# EAGLE design dsd01-bsta (EAGLE 7.7.0)
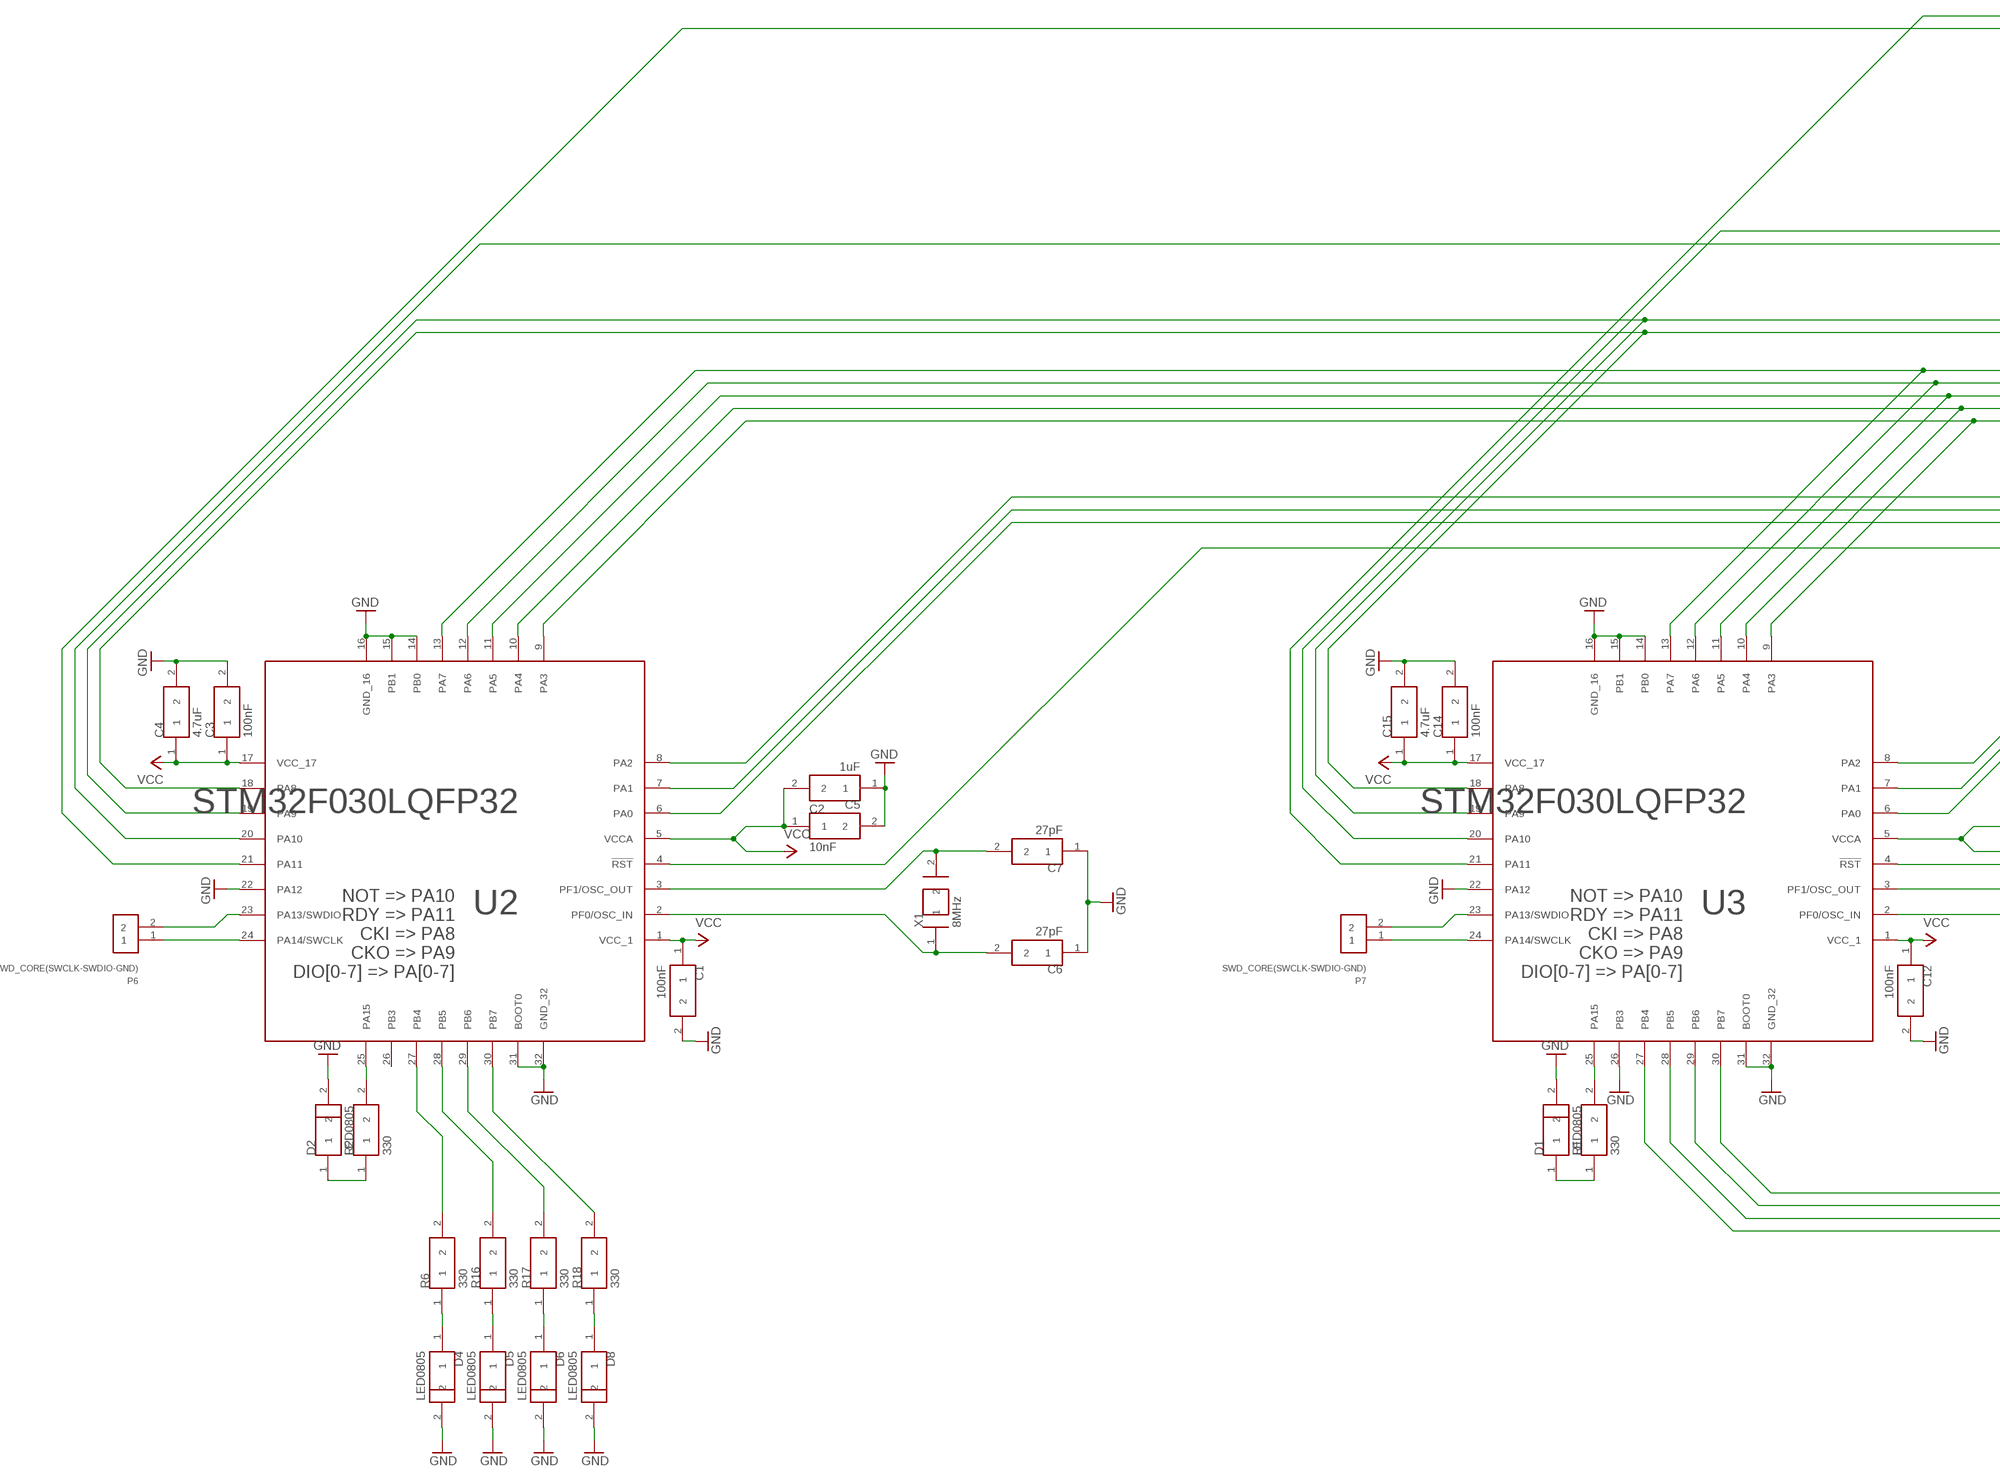
[diagram p0: schematic, sheet 1, part 1 of 2]
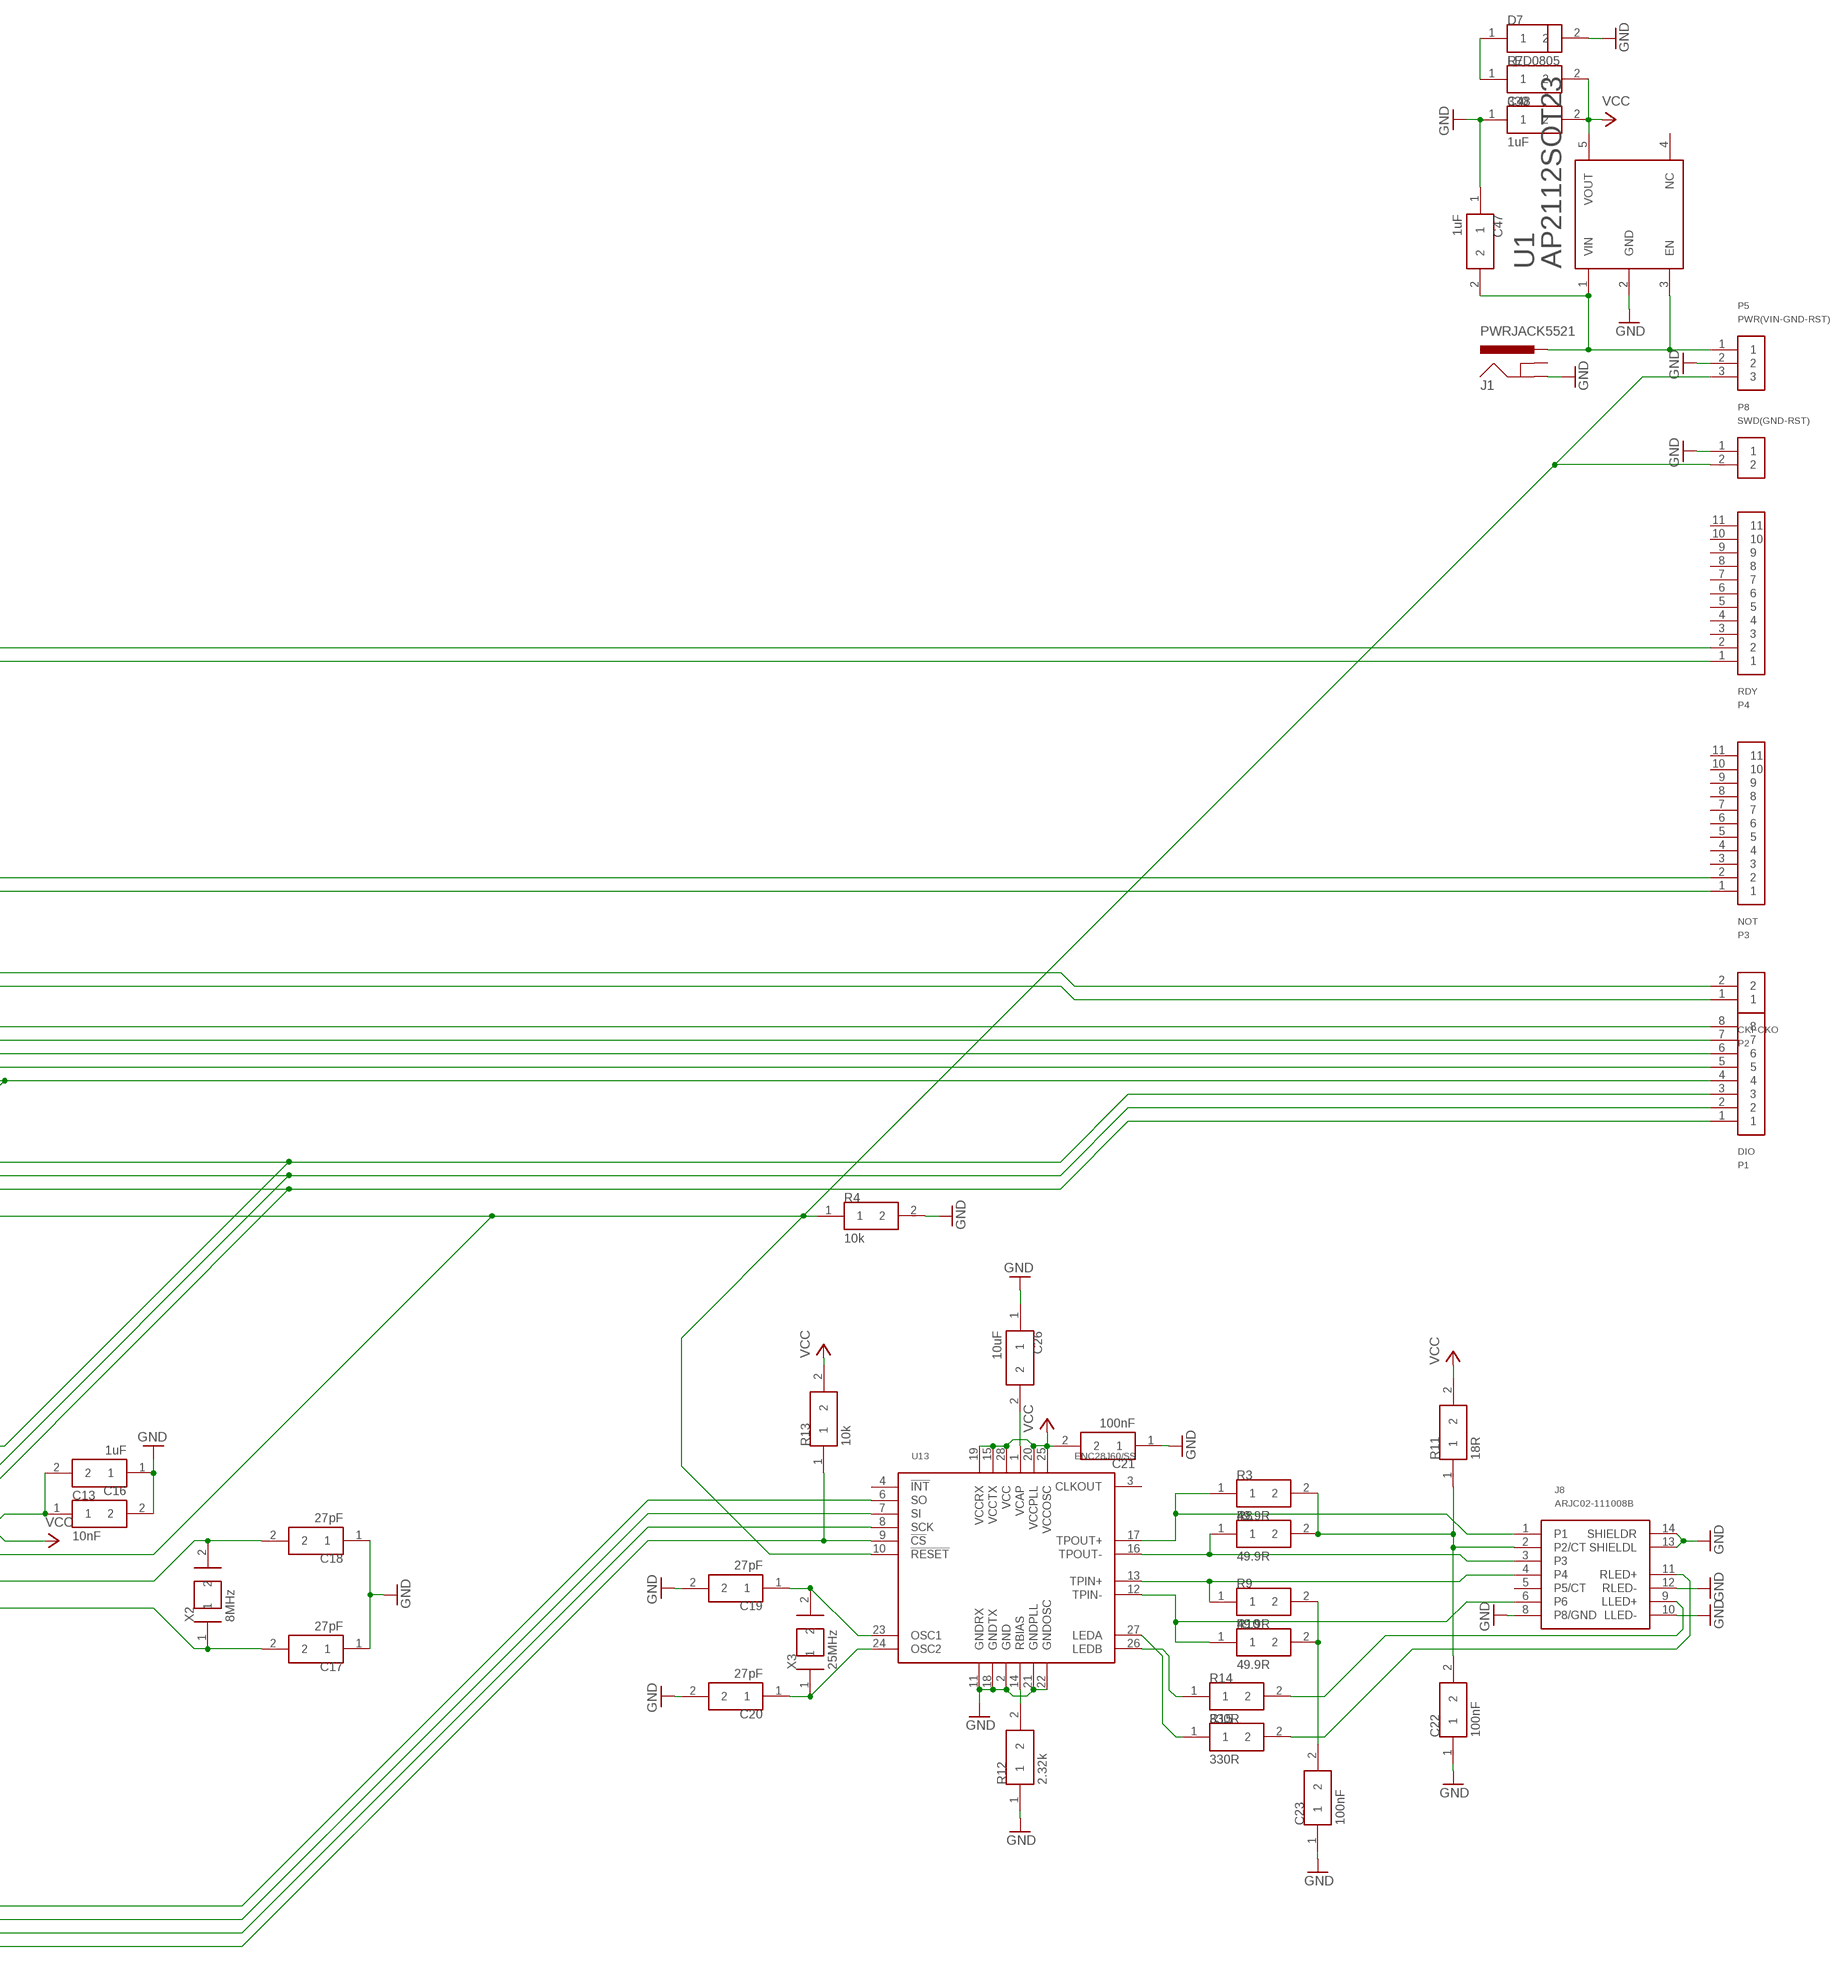
[diagram p1: schematic, sheet 1, part 2 of 2]

## Parts
C1  100nF  CAP0805  [0805]
C2  10nF  CAP0805  [0805]
C3  100nF  CAP0805  [0805]
C4  4.7uF  CAP0805  [0805]
C5  1uF  CAP0805  [0805]
C6  27pF  CAP0805  [0805]
C7  27pF  CAP0805  [0805]
C12  100nF  CAP0805  [0805]
C13  10nF  CAP0805  [0805]
C14  100nF  CAP0805  [0805]
C15  4.7uF  CAP0805  [0805]
C16  1uF  CAP0805  [0805]
C17  27pF  CAP0805  [0805]
C18  27pF  CAP0805  [0805]
C19  27pF  CAP0805  [0805]
C20  27pF  CAP0805  [0805]
C21  100nF  CAP0805  [0805]
C22  100nF  CAP0805  [0805]
C23  100nF  CAP0805  [0805]
C26  10uF  CAP0805  [0805]
C47  1uF  CAP0805  [0805]
C48  1uF  CAP0805  [0805]
D1  LED0805  [0805]
D2  LED0805  [0805]
D4  LED0805  [0805]
D5  LED0805  [0805]
D6  LED0805  [0805]
D7  LED0805  [0805]
D8  LED0805  [0805]
J1  PWRJACK5521  [PWRJACK_5521]
J8  ARJC02-111008B  [ARJC02-111008B]
P1  DIO  PIN_8  [PIN_8]
P2  CKI-CKO  PIN_2  [PIN_2]
P3  NOT  PIN_11  [PIN_11]
P4  RDY  PIN_11  [PIN_11]
P5  PWR(VIN-GND-RST)  PIN_3  [PIN_3]
P6  SWD_CORE(SWCLK-SWDIO-GND)  PIN_2  [PIN_2]
P7  SWD_CORE(SWCLK-SWDIO-GND)  PIN_2  [PIN_2]
P8  SWD(GND-RST)  PIN_2  [PIN_2]
R1  330  RES0805  [0805]
R2  330  RES0805  [0805]
R3  49.9R  RES0805  [0805]
R4  10k  RES0805  [0805]
R6  330  RES0805  [0805]
R7  330  RES0805  [0805]
R8  49.9R  RES0805  [0805]
R9  49.9R  RES0805  [0805]
R10  49.9R  RES0805  [0805]
R11  18R  RES0805  [0805]
R12  2.32k  RES0805  [0805]
R13  10k  RES0805  [0805]
R14  330R  RES0805  [0805]
R15  330R  RES0805  [0805]
R16  330  RES0805  [0805]
R17  330  RES0805  [0805]
R18  330  RES0805  [0805]
U1  AP2112SOT23  [SOT23-5]
U2  STM32F030LQFP32  [QFP32]
U3  STM32F030LQFP32  [QFP32]
U13  ENC28J60/SS  [SSOP28]
X1  8MHz  XTALSMD-5X32  [XTAL_532]
X2  8MHz  XTALSMD-5X32  [XTAL_532]
X3  25MHz  XTALSMD-5X32  [XTAL_532]

## Nets
GND: C1.2 C2.2 C3.2 C4.2 C5.1 C6.1 C7.1 C12.2 C13.2 C14.2 C15.2 C16.1 C17.1 C18.1 C19.2 C20.2 C21.1 C22.1 C23.1 C26.1 C47.1 C48.1 D1.2 D2.2 D4.2 D5.2 D6.2 D7.2 D8.2 J1.GND J8.8(P8/GND) J8.10(LLED-) J8.12(RLED-) J8.13(SHIELDL) J8.14(SHIELDR) P5.2 P8.1 R4.2 R12.1 U1.2(GND) U2.14(PB0) U2.15(PB1) U2.16(GND_16) U2.22(PA12) U2.31(BOOT0) U2.32(GND_32) U3.14(PB0) U3.15(PB1) U3.16(GND_16) U3.22(PA12) U3.26(PB3) U3.31(BOOT0) U3.32(GND_32) U13.2(GND) U13.11(GNDRX) U13.18(GNDTX) U13.21(GNDPLL) U13.22(GNDOSC)
N$1: C47.2 J1.PWR P5.1 U1.1(VIN) U1.3(EN)
N$2: C6.2 U2.2(PF0/OSC_IN) X1.1
N$3: C7.2 U2.3(PF1/OSC_OUT) X1.2
N$4: P3.1 U2.20(PA10)
N$5: P4.1 U2.21(PA11)
N$6: P1.2 U2.7(PA1) U3.7(PA1)
N$7: P1.3 U2.8(PA2) U3.8(PA2)
N$8: P1.4 U2.9(PA3) U3.9(PA3)
N$9: P1.5 U2.10(PA4) U3.10(PA4)
N$10: P1.6 U2.11(PA5) U3.11(PA5)
N$11: P1.7 U2.12(PA6) U3.12(PA6)
N$12: P1.8 U2.13(PA7) U3.13(PA7)
N$13: P2.2 U2.19(PA9) U3.19(PA9)
N$14: P2.1 U2.18(PA8) U3.18(PA8)
N$15: P1.1 U2.6(PA0) U3.6(PA0)
N$17: P6.2 U2.23(PA13/SWDIO)
N$18: P6.1 U2.24(PA14/SWCLK)
N$19: D2.1 R2.1
N$20: R2.2 U2.25(PA15)
N$21: U3.30(PB7) U13.6(SO)
N$22: U3.29(PB6) U13.7(SI)
N$23: U3.28(PB5) U13.8(SCK)
N$24: P5.3 P8.2 R4.1 U2.4(!RST) U3.4(!RST) U13.10(!RESET)
N$25: C22.2 J8.2(P2/CT) R3.2 R8.2 R11.1
N$26: R15.1 U13.27(LEDA)
N$27: R14.1 U13.26(LEDB)
N$28: J8.9(LLED+) R14.2
N$29: J8.11(RLED+) R15.2
N$30: R6.2 U2.27(PB4)
N$31: R16.2 U2.28(PB5)
N$32: C17.2 U3.2(PF0/OSC_IN) X2.1
N$33: C18.2 U3.3(PF1/OSC_OUT) X2.2
N$34: R17.2 U2.29(PB6)
N$35: R18.2 U2.30(PB7)
N$37: D4.1 R6.1
N$38: D5.1 R16.1
N$39: D6.1 R17.1
N$40: D8.1 R18.1
N$42: P7.2 U3.23(PA13/SWDIO)
N$44: P4.2 U3.21(PA11)
N$51: P7.1 U3.24(PA14/SWCLK)
N$54: D1.1 R1.1
N$56: R1.2 U3.25(PA15)
N$58: C26.2 U13.1(VCAP)
N$59: R12.2 U13.14(RBIAS)
N$61: C20.1 U13.24(OSC2) X3.1
N$62: C19.1 U13.23(OSC1) X3.2
N$66: J8.4 R9.1 U13.13(TPIN+)
N$67: J8.6 R10.1 U13.12(TPIN-)
N$68: C23.2 R9.2 R10.2
N$69: J8.1 R3.1 U13.17(TPOUT+)
N$70: J8.3 R8.1 U13.16(TPOUT-)
N$75: R13.1 U3.27(PB4) U13.9(!CS)
N$86: P3.2 U3.20(PA10)
N$112: D7.1 R7.1
VCC: C1.1 C2.1 C3.1 C4.1 C5.2 C12.1 C13.1 C14.1 C15.1 C16.2 C21.2 C48.2 R7.2 R11.2 R13.2 U1.5(VOUT) U2.1(VCC_1) U2.5(VCCA) U2.17(VCC_17) U3.1(VCC_1) U3.5(VCCA) U3.17(VCC_17) U13.15(VCCTX) U13.19(VCCRX) U13.20(VCCPLL) U13.25(VCCOSC) U13.28(VCC)
Unconnected: J1.GNDBREAK J8.5(P5/CT) P3.3 P3.4 P3.5 P3.6 P3.7 P3.8 P3.9 P3.10 P3.11 P4.3 P4.4 P4.5 P4.6 P4.7 P4.8 P4.9 P4.10 P4.11 U1.4(NC) U2.26(PB3) U13.3(CLKOUT) U13.4(!INT)

## Notes on the sheet
- NOT => PA10
  RDY => PA11
  CKI => PA8
  CKO => PA9
  DIO[0-7] => PA[0-7]
- NOT => PA10
  RDY => PA11
  CKI => PA8
  CKO => PA9
  DIO[0-7] => PA[0-7]

## Library data of the parts
C1-C7 C12-C23 C26 C47 C48 = dooba:CAP
D1 D2 D4-D8 = dooba:LED
J1 = dooba:PWRJACK
J8 = pahoo:ARJC02-111008B
P1 = dooba:PIN_8
P2 P6-P8 = dooba:PIN_2
P3 P4 = dooba:PIN_11
P5 = dooba:PIN_3
R1-R4 R6-R18 = dooba:RES
U1 = dooba:AP2112
U2 U3 = dooba:STM32F030
U13 = pahoo:ENC28J60/SS
X1-X3 = dooba:XTAL

## Board
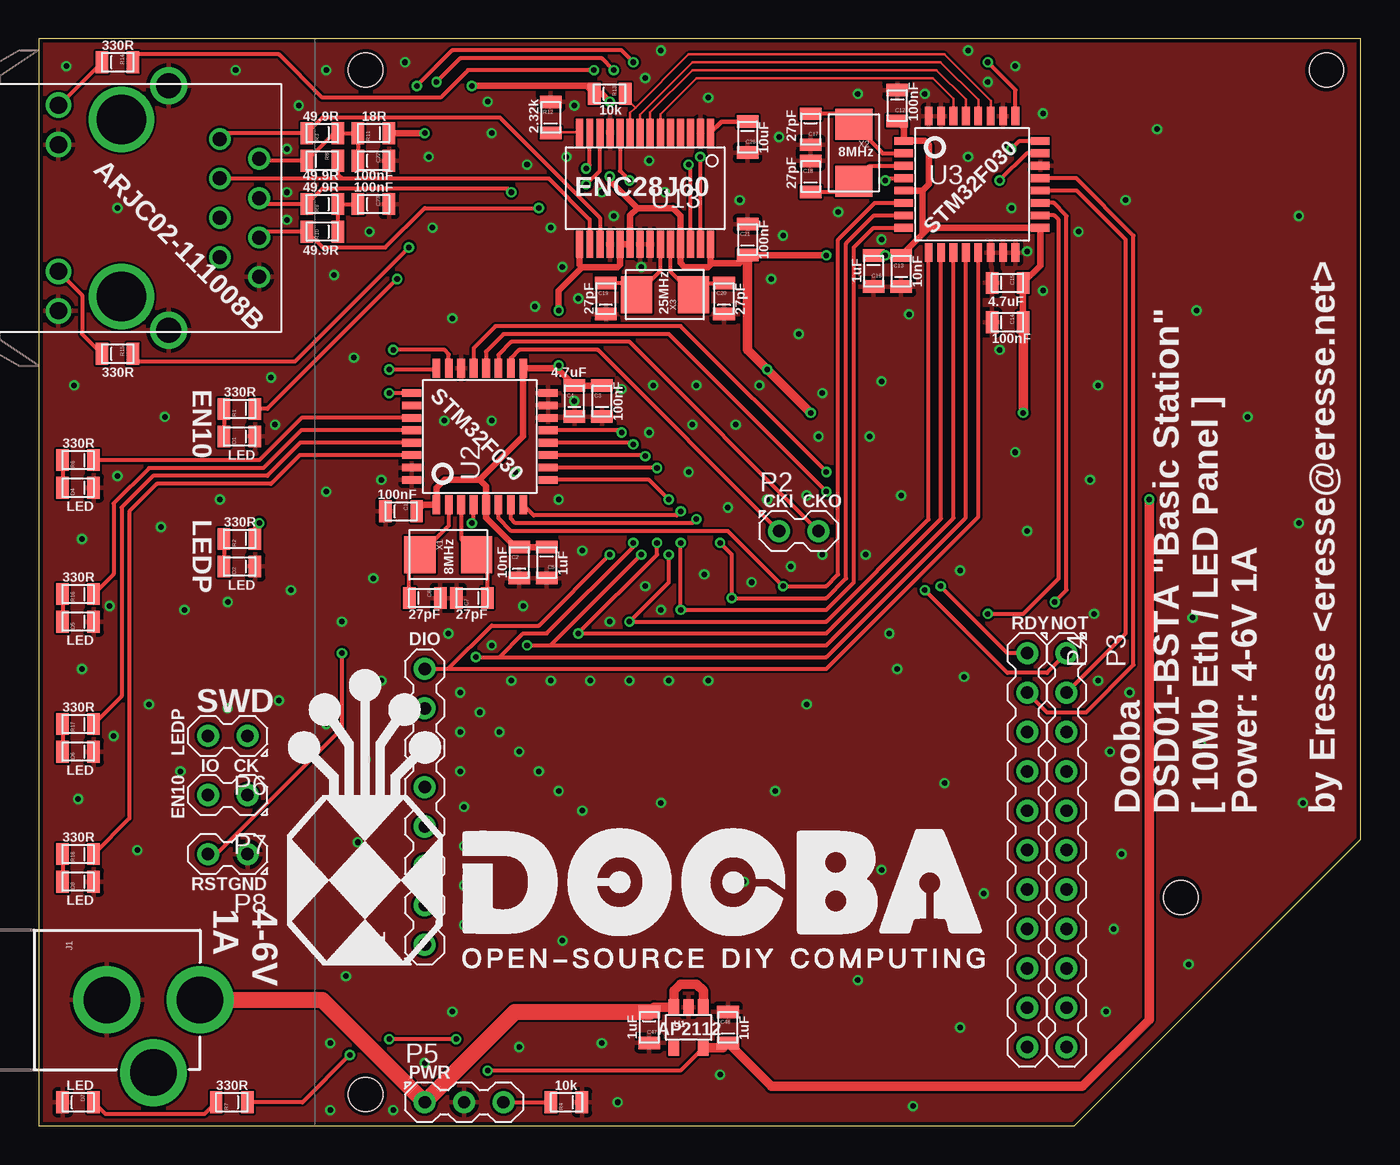
[diagram p2: board, top side]
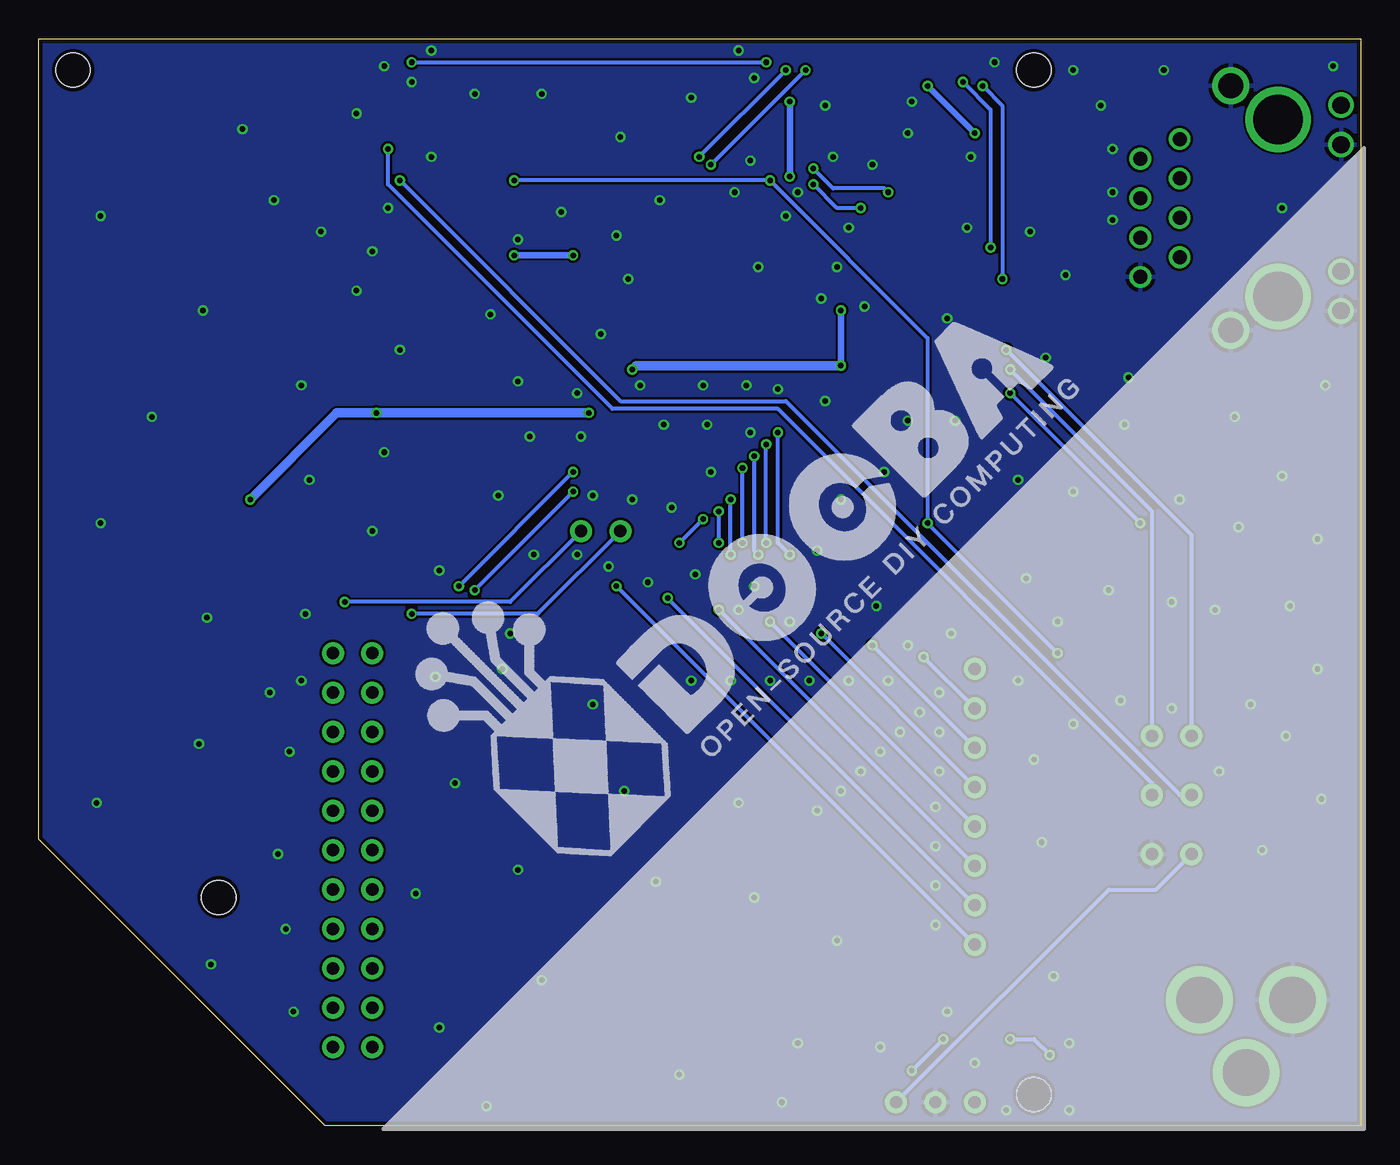
[diagram p3: board, bottom side, seen from below]

Size 85.27 x 70.09 mm. Coordinates in mm from the lower left corner, seen from the top.
Outline: 0,0 66.79,0 85.27,18.48 85.27,70.09 0,70.09 0,0
Copper layers (1*16): Top 0.035mm / dielectric 1.5mm / Bottom 0.035mm
Design rules "dooba": minimum track width 5mil, minimum drill 12mil, track to track 6mil, track to pad 6mil, pad to pad 5mil, via to via 5mil, smd to smd 0mil, copper to edge 10mil, drill to drill 10mil, minimum pad ring 10mil, minimum via ring 6mil, stop-mask expansion 2mil, vias tented up to drill 25mil, thermal gap 10mil
Holes 2.2 mm at 21.08,2.03 21.08,68.07 83.06,68.07 73.66,14.73

### Footprints (pad centres in the part's own frame; a part is rotated, then mirrored left to right if it is on the bottom)
0805 = smd 0.8 x 1.4: 1 -1,0; 2 1,0
PWRJACK_5521 = drill 2.997 pad 4.318: GND 0,0.08; GNDBREAK 4.7,3.08; PWR 0,6.08
ARJC02-111008B = drill 0.9: 1 -4.445,6.6; 2 -3.175,9.14; 3 -1.905,6.6; 4 -0.635,9.14; 5 0.635,6.6; 6 1.905,9.14; 7 3.175,6.6; 8 4.445,9.14 | drill 1.1: 9 -6.63,-3.81; 10 -4.09,-3.81; 11 4.09,-3.81; 12 6.63,-3.81 | drill 1.6: 13 -7.875,3.3; 14 7.875,3.3 | drill 3.2: 15 -5.715,0.25; 16 5.715,0.25
PIN_8 = drill 0.8 pad 1.422: 1 -8.89,0; 2 -6.35,0; 3 -3.81,0; 4 -1.27,0; 5 1.27,0; 6 3.81,0; 7 6.35,0; 8 8.89,0
PIN_2 = drill 0.8 pad 1.422: 1 -1.27,0; 2 1.27,0
PIN_11 = drill 0.8 pad 1.422: 1 -12.7,0; 2 -10.16,0; 3 -7.62,0; 4 -5.08,0; 5 -2.54,0; 6 0,0; 7 2.54,0; 8 5.08,0; 9 7.62,0; 10 10.16,0; 11 12.7,0
PIN_3 = drill 0.8 pad 1.422: 1 -2.54,0; 2 0,0; 3 2.54,0
SOT23-5 = smd 0.66 x 1: 1 0.95,1.315; 2 0,1.315; 3 -0.95,1.315; 4 -0.95,-1.315; 5 0.95,-1.315
QFP32 = smd 1.2 x 0.5: 1 -4.4,2.8; 2 -4.4,2; 3 -4.4,1.2; 4 -4.4,0.4; 5 -4.4,-0.4; 6 -4.4,-1.2; 7 -4.4,-2; 8 -4.4,-2.8; 17 4.4,-2.8; 18 4.4,-2; 19 4.4,-1.2; 20 4.4,-0.4; 21 4.4,0.4; 22 4.4,1.2; 23 4.4,2; 24 4.4,2.8 | smd 0.5 x 1.2: 9 -2.8,-4.4; 10 -2,-4.4; 11 -1.2,-4.4; 12 -0.4,-4.4; 13 0.4,-4.4; 14 1.2,-4.4; 15 2,-4.4; 16 2.8,-4.4; 25 2.8,4.4; 26 2,4.4; 27 1.2,4.4; 28 0.4,4.4; 29 -0.4,4.4; 30 -1.2,4.4; 31 -2,4.4; 32 -2.8,4.4
SSOP28 = smd 0.45 x 1.75: 1 -4.225,-3.6; 2 -3.575,-3.6; 3 -2.925,-3.6; 4 -2.275,-3.6; 5 -1.625,-3.6; 6 -0.975,-3.6; 7 -0.325,-3.6; 8 0.325,-3.6; 9 0.975,-3.6; 10 1.625,-3.6; 11 2.275,-3.6; 12 2.925,-3.6; 13 3.575,-3.6; 14 4.225,-3.6; 15 4.225,3.6; 16 3.575,3.6; 17 2.925,3.6; 18 2.275,3.6; 19 1.625,3.6; 20 0.975,3.6; 21 0.325,3.6; 22 -0.325,3.6; 23 -0.975,3.6; 24 -1.625,3.6; 25 -2.275,3.6; 26 -2.925,3.6; 27 -3.575,3.6; 28 -4.225,3.6
XTAL_532 = smd 2 x 2.4: 1 -1.835,0; 2 1.835,0

### Placement (x,y rotation side)
C1  23.37,39.62 180 top
C2  30.99,36.32 270 top
C3  36.32,46.74 270 top
C4  34.54,46.74 270 top
C5  32.77,36.32 90 top
C6  24.89,34.04 180 top
C7  27.94,34.04 0 top
C12  55.37,65.79 90 top
C13  55.63,55.12 270 top
C14  62.48,51.82 180 top
C15  62.48,54.36 180 top
C16  53.85,55.12 90 top
C17  49.78,64.26 90 top
C18  49.78,61.21 270 top
C19  36.58,53.34 270 top
C20  44.2,53.34 270 top
C21  45.72,57.15 270 top
C22  21.59,62.23 180 top
C23  21.59,59.44 180 top
C26  45.72,63.75 90 top
C47  39.37,6.35 90 top
C48  44.45,6.35 270 top
D1  12.95,44.45 0 top
D2  12.95,36.07 0 top
D4  2.54,41.15 0 top
D5  2.54,32.51 0 top
D6  2.54,24.13 0 top
D7  2.54,1.52 180 top
D8  2.54,15.75 0 top
J1  4.32,8.13 270 top
J8  5.08,59.18 270 top
P1  24.89,20.57 90 top
P2  49.02,38.35 0 top
P3  66.29,17.78 270 top
P4  63.75,17.78 270 top
P5  27.43,1.52 0 top
P6  12.19,25.15 180 top
P7  12.19,21.34 180 top
P8  12.19,17.53 180 top
R1  12.95,46.23 0 top
R2  12.95,37.85 0 top
R3  18.29,64.01 0 top
R4  34.04,1.52 0 top
R6  2.54,42.93 0 top
R7  12.45,1.52 0 top
R8  18.29,62.23 180 top
R9  18.29,59.44 0 top
R10  18.29,57.66 0 top
R11  21.59,64.01 0 top
R12  33.02,65.02 270 top
R13  36.83,66.55 180 top
R14  5.08,68.58 180 top
R15  5.08,49.78 180 top
R16  2.54,34.29 0 top
R17  2.54,25.91 0 top
R18  2.54,17.53 0 top
U1  41.91,6.35 0 top
U2  28.45,44.45 90 top
U3  60.2,60.71 0 top
U13  39.12,60.45 180 top
X1  26.42,36.83 0 top
X2  52.58,62.74 270 top
X3  40.39,53.59 180 top

### Tracks (layer width: path | path; a pad name or v marks a point on that pad's centre or on a via)
GND  (via drill 0.36)
  other vias: 21.34,57.66 25.4,57.91 33.02,57.91 26.67,52.07 15.24,45.21 20.32,49.53 19.05,54.86 5.08,59.18 18.54,68.07 23.62,68.58 39.12,67.56 40.13,69.34 43.18,66.29 47.75,63.75 52.83,66.55 57.15,66.55 59.94,62.48 62.74,59.18 54.36,57.15 51.56,58.93 48.01,57.4 45.21,59.69 39.37,62.23 40.39,60.2 37.08,58.67 36.32,60.2 31.5,61.98 29.21,64.01 25.15,62.48 28.96,66.04 34.54,65.79 61.21,67.31 59.94,69.34 62.99,68.33 64.77,65.28 64.77,53.85 67.06,57.66 70.1,59.69 62.99,43.43 61.98,50.04 56.13,52.32 54.36,48.01 53.59,44.45 55.63,40.64 53.34,36.83 59.44,35.81 63.75,38.35 67.82,41.66 68.33,47.75 68.07,33.02 68.33,28.7 70.36,27.94 69.09,24.13 69.85,17.53 68.83,7.37 69.34,12.7 74.42,32.77 81.53,20.83 74.93,24.64 81.28,38.86 77.98,45.72 74.68,52.58 81.28,58.67 72.14,64.26 35.05,37.08 33.53,40.39 39.12,34.8 42.93,35.56 45.97,35.05 48.51,36.07 50.55,36.83 54.86,31.75 59.69,28.96 46.99,40.39 44.45,39.88 39.37,44.7 42.16,45.21 44.96,45.21 49.53,40.64 50.55,47.24 50.29,44.45 46.48,47.75 42.42,47.75 39.62,47.75 37.59,47.5 34.54,46.74 30.73,42.16 29.21,45.47 26.16,45.47 22.1,41.66 18.54,40.89 31.24,33.53 26.42,31.75 19.56,32.51 18.54,25.91 12.19,33.78 12.19,26.92 11.68,40.39 7.87,38.61 9.4,33.27 7.11,27.18 9.14,22.86 6.35,17.78 5.08,41.91 2.79,37.85 4.57,33.53 2.79,29.46 4.83,25.15 2.54,21.08 2.29,47.75 8.13,45.72 14.99,48.26 16.76,65.79 12.7,68.07 1.78,68.33 21.59,35.31 15.49,27.43 16.26,34.54 22.1,28.7 27.18,27.94 28.45,26.67 29.72,25.4 30.99,24.13 32.26,22.86 33.53,21.59 30.48,28.7 33.02,28.7 35.56,28.7 38.1,28.7 40.64,28.7 43.18,28.7 35.05,20.32 27.18,25.4 27.18,22.86 27.43,20.57 27.43,18.03 27.43,15.49 27.43,12.95 33.78,11.94 40.13,20.83 47.5,21.59 55.37,29.46 58.42,22.1 59.44,6.35 60.96,14.99 52.83,9.4 45.47,15.75 54.36,16.51 49.53,27.18 39.12,14.73 20.57,18.29 21.08,23.62 19.81,9.65 24.89,4.06 30.99,5.08 36.32,5.33 43.94,3.3 37.34,1.52 56.39,1.27 74.17,10.41 18.8,5.33 18.8,1.02 22.86,1.02 26.67,7.37 41.91,42.16 47.24,54.61 49.02,51.05 38.86,55.37 34.8,53.34 32,52.83 33.78,55.37 16,60.2 16,58.42 16,62.99 34.04,62.48 63.75,56.39 29.21,30.99 36.83,32.51 40.13,33.27
  pour Top: 0,70.1 0,0 66.8,0 85.34,18.54 85.34,70.1
  pour Bottom: 0,70.1 85.34,70.1 85.34,18.54 66.8,0 0,0
N$1
  Top 0.61: C47.2 39.68,7.66 U1.3 40.96,8.7 41.4,9.14 42.42,9.14 42.86,8.7 U1.1
  Top 1.016: J1.PWR 18.29,8.13 P5.1 30.72,7.35 C47.2
N$2
  Top 0.254: U2.2 26.45,38.7 X1.1 23.89,36.14 C6.2
N$3
  Top 0.254: U2.3 27.25,37.83 X1.2 28.94,36.14 C7.2
N$4  (via drill 0.36)
  Top 0.254: P3.1 65.02,29.21 62.48,29.21 v57.15,34.54 | v50.8,40.89 40.64,51.05 29.97,51.05 28.85,49.93 U2.20
  Bottom 0.254: v57.15,34.54 v50.8,40.89
N$5  (via drill 0.36)
  Top 0.254: P4.1 62.48,30.48 v58.17,34.8 | v50.8,42.16 41.4,51.56 29.46,51.56 28.05,50.15 U2.21
  Bottom 0.254: v58.17,34.8 v50.8,42.16
N$6  (via drill 0.36)
  Top 0.254: U3.7 53.88,58.71 52.07,56.9 52.07,35.31 50.8,34.04 v44.7,34.04 44.7,36.83 v43.94,37.59 | v42.42,39.12 42.16,38.86 30.73,38.86 30.45,39.15 U2.7
  Bottom 0.254: P1.2 v44.7,34.04 | v43.94,37.59 v42.42,39.12
N$7  (via drill 0.36)
  Top 0.254: U3.8 53.84,57.91 52.58,56.64 52.58,35.05 50.8,33.27 v41.4,33.27 v41.4,37.59 | v41.4,39.62 41.15,39.37 31.93,39.37 U2.8
  Bottom 0.254: P1.3 v41.4,33.27 | v41.4,37.59 v41.4,39.62
N$8  (via drill 0.36)
  Top 0.254: U3.9 57.4,39.11 50.8,32.51 v38.1,32.51 40.64,35.05 v40.64,36.83 | v40.64,40.39 39.38,41.65 U2.9
  Bottom 0.254: P1.4 v38.1,32.51 | v40.64,36.83 v40.64,40.39
N$9  (via drill 0.36)
  Top 0.254: U3.10 58.2,39.15 50.8,31.75 v34.8,31.75 39.88,36.83 v39.88,37.59 | v39.88,42.42 39.85,42.45 U2.10
  Bottom 0.254: P1.5 v34.8,31.75 | v39.88,37.59 v39.88,42.42
N$10  (via drill 0.36)
  Top 0.254: v31.5,30.99 33.02,30.99 | 33.02,30.99 50.8,30.99 59,39.19 U3.11 | 33.02,30.99 v38.86,36.83 | v39.12,43.18 39.05,43.25 U2.11
  Bottom 0.254: P1.6 v31.5,30.99 | v38.86,36.83 39.12,37.08 v39.12,43.18
N$11  (via drill 0.36)
  Top 0.254: v28.19,30.23 29.72,30.23 | 29.72,30.23 50.8,30.23 59.8,39.22 U3.12 | 29.72,30.23 31.24,31.75 32.77,31.75 38.35,37.34 v38.35,37.59 | v38.35,43.94 38.25,44.05 U2.12
  Bottom 0.254: P1.7 v28.19,30.23 | v38.35,37.59 v38.35,43.94
N$12  (via drill 0.36)
  Top 0.254: P1.8 26.42,29.46 | 26.42,29.46 50.8,29.46 60.6,39.26 U3.13 | 26.42,29.46 29.21,32.26 32.26,32.26 v36.83,36.83 | v37.59,44.7 37.45,44.85 U2.13
  Bottom 0.254: v36.83,36.83 37.59,37.59 v37.59,44.7
N$13  (via drill 0.36)
  Top 0.254: P2.2 38.1,50.55 30.48,50.55 29.65,49.71 U2.19 | v65.53,33.78 66.29,34.54 66.29,58.67 65.46,59.51 U3.19
  Bottom 0.254: P2.2 54.86,33.78 v65.53,33.78
N$14  (via drill 0.36)
  Top 0.254: P2.1 36.07,50.04 30.99,50.04 30.45,49.5 U2.18 | v61.21,33.02 63.5,33.02 65.79,35.31 65.79,58.42 65.5,58.71 U3.18
  Bottom 0.254: P2.1 53.09,33.02 v61.21,33.02
N$15  (via drill 0.36)
  Top 0.254: U3.6 53.92,59.51 51.56,57.15 51.56,35.56 50.8,34.8 v48.01,34.8 44.45,38.35 30.48,38.35 29.65,39.19 U2.6
  Bottom 0.254: P1.1 v48.01,34.8
N$17  (via drill 0.36)
  Top 0.254: U2.23 26.45,49.75 26.16,50.04 v22.86,50.04
  Bottom 0.254: v22.86,50.04 10.92,38.1 P6.2
N$18  (via drill 0.36)
  Top 0.254: U2.24 25.57,48.77 v22.61,48.77
  Bottom 0.254: v22.61,48.77 13.46,39.62 P6.1
N$19
  Top 0.254: R2.1 D2.1
N$20  (via drill 0.36)
  Top 0.254: U2.25 24.04,47.24 v22.61,47.24 | v14.22,38.86 13.95,38.59 R2.2
  Bottom 0.254: v22.61,47.24 v14.22,38.86
N$21
  Top 0.152: U3.30 59,66.22 57.66,67.56 42.42,67.56 40.09,65.24 U13.6
N$22
  Top 0.152: U3.29 59.8,66.19 57.91,68.07 42.16,68.07 39.44,65.35 U13.7
N$23
  Top 0.152: U3.28 60.6,66.15 58.17,68.58 42.16,68.58 38.79,65.21 U13.8
N$24  (via drill 0.36)
  Top 0.254: U13.10 37.49,61.57 v38.1,60.96 | v54.61,60.96 54.76,61.11 U3.4 | v27.94,38.86 28.05,38.97 U2.4 | P8.2 11.43,17.53 19.56,25.65 v19.56,30.48 | P5.3 R4.1
  Bottom 0.254: v54.61,60.96 v38.1,60.96 27.94,50.8 v27.94,38.86 v19.56,30.48 | P5.3 16.26,15.24 13.21,15.24 P8.2
N$25
  Top 0.254: J8.2 14.35,62.23 R8.2 19.07,64.01 R3.2 R11.1 C22.2
N$26  (via drill 0.36)
  Top 0.254: U13.27 42.69,62.46 v42.67,62.48 | v37.08,68.07 36.32,68.83 27.18,68.83 v25.65,67.31 | v23.88,56.64 16.51,49.28 6.35,49.28 6.08,49.55 R15.1
  Bottom 0.254: v42.67,62.48 v37.08,68.07 | v25.65,67.31 23.88,65.53 v23.88,56.64
N$27  (via drill 0.36)
  Top 0.254: U13.26 42.04,61.84 v41.91,61.98 | v35.81,68.07 27.69,68.07 25.91,66.29 18.29,66.29 15.49,69.09 6.35,69.09 6.08,68.82 R14.1
  Bottom 0.254: v41.91,61.98 v35.81,68.07
N$28
  Top 0.254: R14.2 1.31,65.81 J8.9
N$29
  Top 0.254: J8.11 2.79,53.57 2.79,51.05 4.06,49.78 R15.2
N$30
  Top 0.254: U2.27 16.95,45.65 14.22,42.93 R6.2
N$31
  Top 0.254: U2.28 16.91,44.85 14.48,42.42 7.11,42.42 4.83,40.13 4.83,35.58 R16.2
N$32
  Top 0.254: U3.2 54.44,62.71 X2.1 51.89,65.26 C17.2
N$33
  Top 0.254: U3.3 53.58,61.91 X2.2 51.89,60.21 C18.2
N$34
  Top 0.254: U2.29 16.87,44.05 14.73,41.91 7.37,41.91 5.33,39.88 5.33,27.7 R17.2
N$35
  Top 0.254: U2.30 16.83,43.25 14.99,41.4 7.62,41.4 5.84,39.62 5.84,19.83 R18.2
N$37
  Top 0.254: R6.1 D4.1
N$38
  Top 0.254: R16.1 D5.1
N$39
  Top 0.254: R17.1 D6.1
N$40
  Top 0.254: R18.1 D8.1
N$42  (via drill 0.36)
  Top 0.254: U3.23 63.72,62.71 v61.98,60.96
  Bottom 0.254: v61.98,60.96 47.75,46.74 37.08,46.74 11.68,21.34 P7.2
N$44
  Top 0.254: P4.2 65.02,26.67 67.56,26.67 70.61,29.72 70.61,57.4 66.91,61.11 U3.21
N$51  (via drill 0.36)
  Top 0.254: v62.74,62.99 63.25,63.51 U3.24
  Bottom 0.254: P7.1 13.46,22.1 37.59,46.23 48.26,46.23 62.74,60.71 v62.74,62.99
N$54
  Top 0.254: R1.1 D1.1
N$56  (via drill 0.36)
  Top 0.254: U3.25 63,66.8 v61.21,68.58 | v38.35,68.58 37.59,69.34 26.67,69.34 v24.38,67.06 | v23.11,54.61 14.73,46.23 R1.2
  Bottom 0.254: v61.21,68.58 v38.35,68.58 | v24.38,67.06 23.11,65.79 v23.11,54.61
N$58
  Top 0.305: C26.2 44.04,64.75 U13.1
N$59
  Top 0.152: U13.14 33.05,64.05 R12.2
N$61
  Top 0.254: U13.24 40.74,55.07 X3.1 42.97,54.34 C20.1
N$62
  Top 0.254: U13.23 40.09,55.13 X3.2 37.8,54.34 C19.1
N$66  (via drill 0.36)
  Top 0.254: v30.48,60.2 30.23,60.45 18.3,60.45 R9.1 14.6,59.44 J8.4 | v35.31,61.72 35.54,61.96 U13.13
  Bottom 0.254: v30.48,60.2 30.73,60.45 34.04,60.45 v35.31,61.72
N$67  (via drill 0.36)
  Top 0.254: v32.26,59.18 24.89,59.18 22.35,56.64 18.3,56.64 R10.1 14.6,57.66 J8.6 | v35.31,60.71 36.19,61.59 U13.12
  Bottom 0.254: v32.26,59.18 33.78,59.18 v35.31,60.71
N$68
  Top 0.254: R10.2 R9.2 C23.2
N$69
  Top 0.254: J8.1 12.06,64.01 R3.1 18.3,65.02 29.72,65.02 36.19,58.55 U13.17
N$70
  Top 0.254: J8.3 19.56,61.09 | 19.56,61.09 32.89,61.09 35.54,58.44 U13.16 | R8.1 19.29,61.36 19.56,61.09
N$75
  Top 0.152: U3.27 61.4,66.11 58.42,69.09 41.91,69.09 38.48,65.66 | 38.48,65.66 38.14,65.32 U13.9 | R13.1 37.83,66.31 38.48,65.66
N$86
  Top 0.254: P3.2 70.1,31.75 70.1,57.15 66.95,60.31 U3.20
N$112
  Top 0.254: R7.1 10.68,0.76 4.32,0.76 3.56,1.52 D7.1
VCC  (via drill 0.36)
  Top 0.254: 43.34,55.53 43.34,55.63 | C21.2 45.74,56.13 | 54.63,56.12 v54.61,56.13 53.86,56.13 C16.2 | U1.5 41.38,3.56 v28.96,3.56 | v26.92,5.59 v22.61,5.59 | v20.07,4.57 17.02,1.52 R7.2
  Top 0.406: C12.1 55.8,64.36 U3.1 57.14,63.51 57.4,63.25 57.4,60.71 57,60.31 | 57,60.31 U3.5 | 57,57.5 C13.1 54.63,56.12 | 57,57.5 57,60.31 | C14.1 C15.1 64.6,55.47 U3.17 57.41,57.91 57,57.5 | U13.15 34.89,55.53 35.05,55.37 | 35.05,55.37 37.34,55.37 37.49,55.52 U13.19 U13.20 38.14,58.71 38.61,59.18 | 43.34,55.53 43.18,55.37 41.66,55.37 41.39,55.64 U13.25 41.39,58.68 40.89,59.18 38.61,59.18 | U13.28 43.34,55.63 45.2,55.63 C21.2 | 45.74,56.13 v50.8,56.13 | 38.61,59.18 36.83,60.96 v36.83,61.21 | v36.83,66.04 36.32,66.55 R13.2 35.32,67.06 v27.94,67.06 | v24.89,64.01 R11.2 | C5.2 C2.1 30.75,37.32 28.85,39.22 U2.5 28.85,41.26 28.45,41.66 | C1.1 24.79,40.05 U2.1 25.65,41.14 26.16,41.66 28.45,41.66 | 28.45,41.66 31.25,44.46 U2.17 33.43,48.85 | 33.43,48.85 C4.1 C3.1 | 35.05,55.37 33.53,53.85 v33.53,52.58 | v33.53,49.02 33.53,48.95 33.43,48.85
  Top 0.61: U1.5 44.13,5.03 C48.2 47.26,2.54 67.31,2.54 71.63,6.86 v71.63,40.39 | v49.78,45.97 v46.99,48.77 45.72,50.04 45.72,56.13 | C14.1 63.5,51.8 v63.5,45.97
  Bottom 0.254: v28.96,3.56 v26.92,5.59 | v22.61,5.59 21.08,5.59 v20.07,4.57
  Bottom 0.406: v50.8,56.13 v54.61,56.13 | v36.83,61.21 v36.83,66.04 | v27.94,67.06 v24.89,64.01 | v33.53,52.58 v33.53,49.02
  Bottom 0.61: v71.63,40.39 66.04,45.97 v63.5,45.97 v49.78,45.97 | v46.99,48.77 46.74,49.02 v33.53,49.02

### Text on the board
tPlace: 330R | 100nF | 10k | 27pF | 49.9R | 18R | 10uF | 2.32k | 27pF | 8MHz | 49.9R | 100nF | 49.9R | 100nF | ENC28J60 | 100nF | STM32F030 | 49.9R | 10nF | 27pF | 1uF | 4.7uF | ARJC02-111008B | 27pF | 25MHz | 100nF | 330R | EN10 | 4.7uF | 100nF | 330R | STM32F030 | 330R | LED | LED | 100nF | CKI | CKO | LEDP | 330R | 8MHz | 1uF | 330R | LED | 10nF | 27pF | 27pF | RDY | NOT | LED | DIO | 330R | SWD | LEDP | IO | CK | LED | EN10 | Dooba / DSD01-BSTA "Basic Station" / [ 10Mb Eth / LED Panel ] / Power: 4-6V 1A / / by Eresse <eresse@eresse.net> | 330R | RST | GND | LED | 4-6V / 1A | 1uF | 1uF | AP2112 | PWR | LED | 330R | 10k